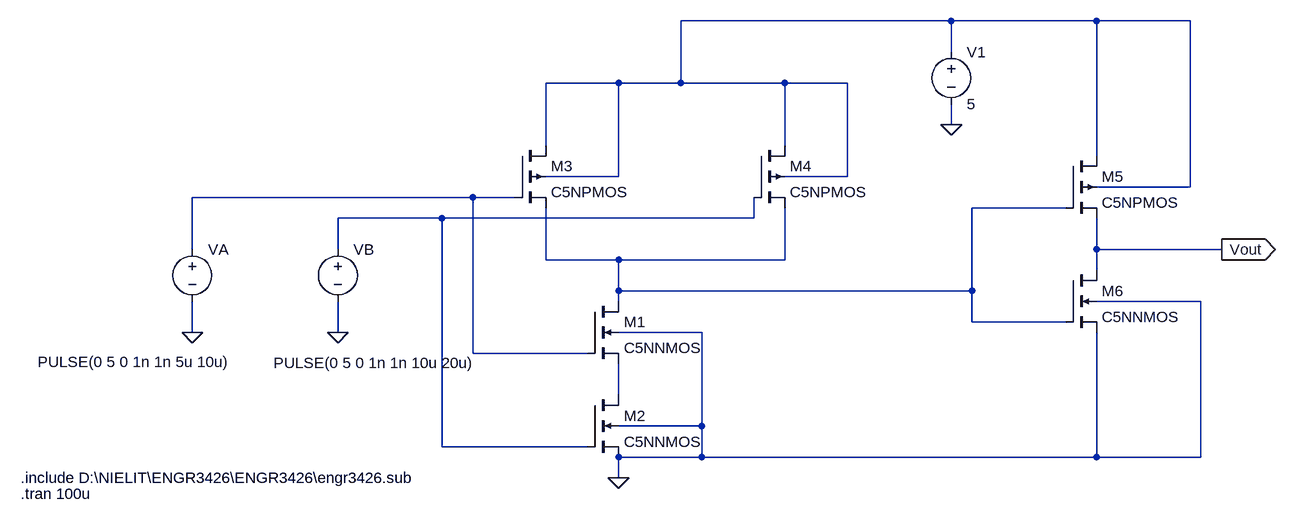
[diagram p0: schematic AND.asc]
AND.asc, the LTspice schematic file:
Version 4
SHEET 1 1200 680
WIRE 672 -160 256 -160
WIRE 896 -160 672 -160
WIRE 1040 -160 896 -160
WIRE 672 -112 672 -160
WIRE 160 -64 48 -64
WIRE 256 -64 256 -160
WIRE 256 -64 160 -64
WIRE 416 -64 256 -64
WIRE 512 -64 416 -64
WIRE 672 0 672 -32
WIRE 48 32 48 -64
WIRE 416 32 416 -64
WIRE 896 48 896 -160
WIRE 160 80 160 -64
WIRE 160 80 48 80
WIRE 512 80 512 -64
WIRE 512 80 416 80
WIRE 1040 96 1040 -160
WIRE 1040 96 896 96
WIRE -64 112 -496 112
WIRE 0 112 -64 112
WIRE 848 128 704 128
WIRE -112 144 -272 144
WIRE 368 144 368 112
WIRE 368 144 -112 144
WIRE -496 192 -496 112
WIRE -272 192 -272 144
WIRE 896 192 896 144
WIRE 1088 192 896 192
WIRE 48 208 48 128
WIRE 160 208 48 208
WIRE 416 208 416 128
WIRE 416 208 160 208
WIRE 896 224 896 192
WIRE 160 256 160 208
WIRE 704 256 704 128
WIRE 704 256 160 256
WIRE 160 272 160 256
WIRE 1056 272 896 272
WIRE 704 304 704 256
WIRE 848 304 704 304
WIRE -496 320 -496 272
WIRE -272 320 -272 272
WIRE 288 320 160 320
WIRE -64 352 -64 112
WIRE 112 352 -64 352
WIRE 160 416 160 368
WIRE 288 464 288 320
WIRE 288 464 160 464
WIRE -112 496 -112 144
WIRE 112 496 -112 496
WIRE 288 512 288 464
WIRE 288 512 160 512
WIRE 896 512 896 320
WIRE 896 512 288 512
WIRE 1056 512 1056 272
WIRE 1056 512 896 512
WIRE 160 544 160 512
FLAG -496 320 0
FLAG -272 320 0
FLAG 672 0 0
FLAG 160 544 0
FLAG 1088 192 Vout
IOPIN 1088 192 Out
SYMBOL nmos4 112 272 R0
SYMATTR InstName M1
SYMATTR Value C5NNMOS
SYMATTR Value2 l=0.6u w=3.6u
SYMBOL nmos4 112 416 R0
SYMATTR InstName M2
SYMATTR Value C5NNMOS
SYMATTR Value2 l=0.6u w=3.6u
SYMBOL pmos4 0 32 R0
SYMATTR InstName M3
SYMATTR Value C5NPMOS
SYMATTR Value2 l=0.6u w=7.2u
SYMBOL pmos4 368 32 R0
SYMATTR InstName M4
SYMATTR Value C5NPMOS
SYMATTR Value2 l=0.6u w=7.2u
SYMBOL voltage 672 -128 R0
SYMATTR InstName V1
SYMATTR Value 5
SYMBOL voltage -496 176 R0
WINDOW 3 -238 189 Left 2
WINDOW 123 0 0 Left 0
WINDOW 39 0 0 Left 0
SYMATTR InstName VA
SYMATTR Value PULSE(0 5 0 1n 1n 5u 10u)
SYMBOL voltage -272 176 R0
WINDOW 3 -99 191 Left 2
WINDOW 123 0 0 Left 0
WINDOW 39 0 0 Left 0
SYMATTR InstName VB
SYMATTR Value PULSE(0 5 0 1n 1n 10u 20u)
SYMBOL pmos4 848 48 R0
SYMATTR InstName M5
SYMATTR Value C5NPMOS
SYMATTR Value2 l=0.6u w=7.2u
SYMBOL nmos4 848 224 R0
SYMATTR InstName M6
SYMATTR Value C5NNMOS
SYMATTR Value2 l=0.6u w=3.6u
TEXT -760 544 Left 2 !.include D:\\NIELIT\\ENGR3426\\ENGR3426\\engr3426.sub
TEXT -760 568 Left 2 !.tran 100u

The netlist it stands for:
* AND.asc
M1 N003 N002 N005 0 C5NNMOS l=0.6u w=3.6u
M2 N005 N004 0 0 C5NNMOS l=0.6u w=3.6u
M3 N001 N002 N003 N001 C5NPMOS l=0.6u w=7.2u
M4 N001 N004 N003 N001 C5NPMOS l=0.6u w=7.2u
V1 N001 0 5
VA N002 0 PULSE(0 5 0 1n 1n 5u 10u)
VB N004 0 PULSE(0 5 0 1n 1n 10u 20u)
M5 N001 N003 Vout N001 C5NPMOS l=0.6u w=7.2u
M6 Vout N003 0 0 C5NNMOS l=0.6u w=3.6u
.model NMOS NMOS
.model PMOS PMOS
.lib standard.mos
.include D:\NIELIT\ENGR3426\ENGR3426\engr3426.sub
.tran 100u
.backanno
.end